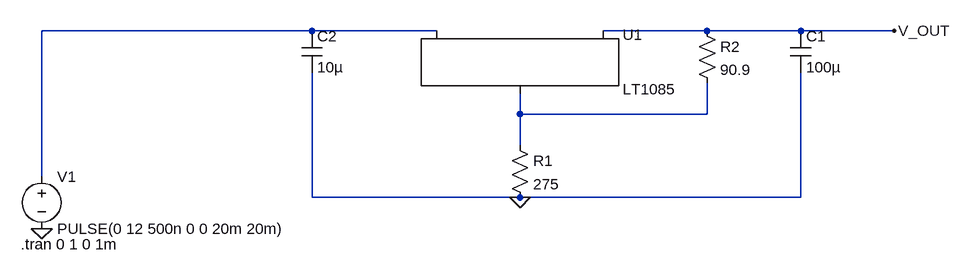
[diagram p0: schematic LT1085_3_3_V_Power_Supply_Schematic.asc]
LT1085_3_3_V_Power_Supply_Schematic.asc, the LTspice schematic file:
Version 4
SHEET 1 1040 680
WIRE 48 80 -368 80
WIRE 240 80 48 80
WIRE 656 80 496 80
WIRE 800 80 656 80
WIRE 944 80 800 80
WIRE 368 208 368 176
WIRE 656 208 656 160
WIRE 656 208 368 208
WIRE 368 256 368 208
WIRE -368 304 -368 80
WIRE 48 336 48 144
WIRE 368 336 48 336
WIRE 800 336 800 144
WIRE 800 336 368 336
FLAG 368 336 0
FLAG 944 80 V_OUT
FLAG -368 384 0
SYMBOL PowerProducts\\LT1085 368 80 R0
SYMATTR InstName U1
SYMBOL voltage -368 288 R0
WINDOW 123 0 0 Left 0
WINDOW 39 0 0 Left 0
SYMATTR InstName V1
SYMATTR Value PULSE(0 12 500n 0 0 20m 20m)
SYMBOL res 352 240 R0
SYMATTR InstName R1
SYMATTR Value 275
SYMBOL res 640 64 R0
SYMATTR InstName R2
SYMATTR Value 90.9
SYMBOL cap 784 80 R0
SYMATTR InstName C1
SYMATTR Value 100µ
SYMBOL cap 32 80 R0
SYMATTR InstName C2
SYMATTR Value 10µ
TEXT -400 408 Left 2 !.tran 0 1 0 1m

The netlist it stands for:
* LT1085_3_3_V_Power_Supply_Schematic.asc
XU1 N002 V_OUT N001 LT1085
V1 N001 0 PULSE(0 12 500n 0 0 20m 20m)
R1 N002 0 275
R2 V_OUT N002 90.9
C1 V_OUT 0 100µ
C2 N001 0 10µ
.tran 0 1 0 1m
.backanno
.end